# Altium project STM32F103RCT6_DEVELOPMENT_BOARD.PrjPcb
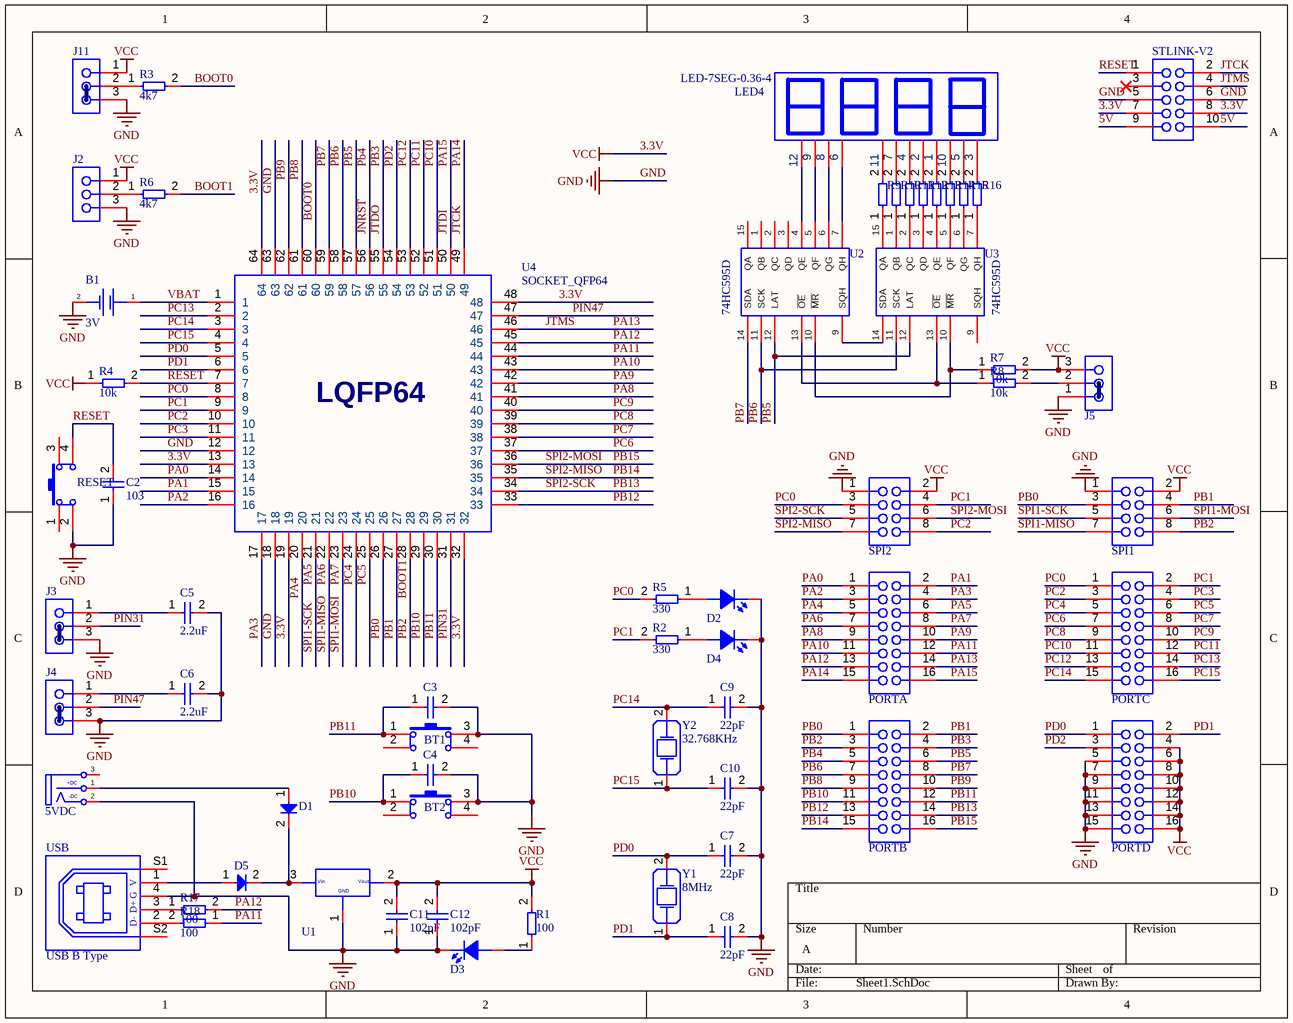
[diagram p0: Sheet1.SchDoc]
1 sheet, 59 parts. Net scope: global (net labels, ports and power ports of the same name join across sheets).
Board file: PCB1.PcbDoc

## Sheet Sheet1.SchDoc
size A

### Parts
5VDC  Connector  [DC_K375A_Power]  (value not drawn)
B1  3V  [CR1220]
BT1  Button Hole  [BUTTON_HOLE_5.0mm]  (value not drawn)
BT2  Button Hole  [BUTTON_HOLE_5.0mm]  (value not drawn)
C2  103  [C0805]
C3  103  [C0805]  (value not drawn)
C4  103  [C0805]  (value not drawn)
C5  2.2uF  [C1206]
C6  2.2uF  [C1206]
C7  22pF  [C0805]
C8  22pF  [C0805]
C9  22pF  [C0805]
C10  22pF  [C0805]
C11  102pF  [C0805]
C12  102pF  [C0805]
D1  1N4007  [DO-214AC(SMA)]  (value not drawn)
D2  LED0805  [L0805RED]  (value not drawn)
D3  LED0805  [L0805RED]  (value not drawn)
D4  LED0805  [L0805RED]  (value not drawn)
D5  1N4007  [DO-214AC(SMA)]  (value not drawn)
J2  BOOT1  [Header 3x1 TH Pitch 2.54mm]  (value not drawn)
J3  PIN31  [Header 3x1 TH Pitch 2.54mm]  (value not drawn)
J4  PIN47  [Header 3x1 TH Pitch 2.54mm]  (value not drawn)
J5  7SEG-OE  [Header 3x1 TH Pitch 2.54mm]  (value not drawn)
J11  BOOT0  [Header 3x1 TH Pitch 2.54mm]  (value not drawn)
LED4  LED-7SEG-0.36-4  [LED-7SEG-0.36-4]
PORTA  Header 8x2 TH Pitch 2.54mm  [Header 8x2 TH Pitch 2.54mm]  (value not drawn)
PORTB  Header 8x2 TH Pitch 2.54mm  [Header 8x2 TH Pitch 2.54mm]  (value not drawn)
PORTC  Header 8x2 TH Pitch 2.54mm  [Header 8x2 TH Pitch 2.54mm]  (value not drawn)
PORTD  Header 8x2 TH Pitch 2.54mm  [Header 8x2 TH Pitch 2.54mm]  (value not drawn)
R1  100  [R0805]
R2  330  [R0805]
R3  4k7  [R0805]
R4  10k  [R0805]
R5  330  [R0805]
R6  4k7  [R0805]
R7  10k  [R0805]
R8  10k  [R0805]
R9  100  [R0805]  (value not drawn)
R10  100  [R0805]  (value not drawn)
R11  100  [R0805]  (value not drawn)
R12  100  [R0805]  (value not drawn)
R13  100  [R0805]  (value not drawn)
R14  100  [R0805]  (value not drawn)
R15  100  [R0805]  (value not drawn)
R16  100  [R0805]  (value not drawn)
R17  100  [R0805]
R18  100  [R0805]
RESET  Button Hole  [BUTTON_HOLE_5.0mm]  (value not drawn)
SPI1  Header 4x2 TH Pitch 2.54mm  [Header 4x2 TH Pitch 2.54mm]  (value not drawn)
SPI2  Header 4x2 TH Pitch 2.54mm  [Header 4x2 TH Pitch 2.54mm]  (value not drawn)
STLINK-V2  IDC_2.54_5x2  [IDC_CONNECTOR_10x2.54]  (value not drawn)
U1  AMS1117  [SOT223-3]  (value not drawn)
U2  74HC595D  [SO16]
U3  74HC595D  [SO16]
U4  SOCKET_QFP64  [SOCKET_QFP64]
USB  USB B Type  [USB-B-TYPE]
Y1  8MHz  [SMD5032]
Y2  32.768KHz  [CRYSTAL 32.768]

### Nets
3.3V: C11.2 C12.2 J2.1 J5.3 J11.1 PORTD.4 PORTD.6 PORTD.8 PORTD.10 PORTD.12 PORTD.14 PORTD.16 R1.2 R4.1 R7.2 SPI1.2 SPI2.2 STLINK-V2.7 STLINK-V2.8 U1.2 U2.16 U3.16 U4.13 U4.19 U4.32 U4.48 U4.64  [also labelled VCC]
GND: 5VDC.2(DC-) B1.2 BT1.3 BT2.3 C2.1 C3.2 C4.2 C5.2 C6.2 C7.2 C8.2 C9.2 C10.2 C11.1 C12.1 D2.2(K) D3.2(K) D4.2(K) J2.3 J3.3 J4.3 J5.1 J11.3 PORTD.5 PORTD.7 PORTD.9 PORTD.11 PORTD.13 PORTD.15 RESET.2 SPI1.1 SPI2.1 STLINK-V2.5 STLINK-V2.6 U1.1 U2.8 U3.8 U4.12 U4.18 U4.63 USB.4
5V: STLINK-V2.9 STLINK-V2.10
BOOT0: R3.2 U4.60
BOOT1: PORTB.3 R6.2 SPI1.8 U4.28  [also labelled PB2]
JNRST: PORTB.5 U4.56  [also labelled Pb4]
JTCK: PORTA.15 STLINK-V2.2 U4.49  [also labelled PA14]
JTDI: PORTA.16 U4.50  [also labelled PA15]
JTDO: PORTB.4 U4.55  [also labelled PB3]
JTMS: PORTA.14 STLINK-V2.4 U4.46  [also labelled PA13]
PA0: PORTA.1 U4.14
PA1: PORTA.2 U4.15
PA2: PORTA.3 U4.16
PA3: PORTA.4 U4.17
PA4: PORTA.5 U4.20
PA5: PORTA.6 SPI1.5 U4.21  [also labelled SPI1-SCK]
PA6: PORTA.7 SPI1.7 U4.22  [also labelled SPI1-MISO]
PA7: PORTA.8 SPI1.6 U4.23  [also labelled SPI1-MOSI]
PA8: PORTA.9 U4.41
PA9: PORTA.10 U4.42
PA10: PORTA.11 U4.43
PA11: PORTA.12 R18.1 U4.44
PA12: PORTA.13 R17.2 U4.45
PB0: PORTB.1 SPI1.3 U4.26
PB1: PORTB.2 SPI1.4 U4.27
PB5: PORTB.6 U2.12(LAT) U3.12(LAT) U4.57
PB6: PORTB.7 U2.11(SCK) U3.11(SCK) U4.58
PB7: PORTB.8 U2.14(SDA) U4.59
PB8: PORTB.9 U4.61
PB9: PORTB.10 U4.62
PB10: BT2.1 C4.1 PORTB.11 U4.29
PB11: BT1.1 C3.1 PORTB.12 U4.30
PB12: PORTB.13 U4.33
PB13: PORTB.14 SPI2.5 U4.34  [also labelled SPI2-SCK]
PB14: PORTB.15 SPI2.7 U4.35  [also labelled SPI2-MISO]
PB15: PORTB.16 SPI2.6 U4.36  [also labelled SPI2-MOSI]
PC0: PORTC.1 R5.2 SPI2.3 U4.8
PC1: PORTC.2 R2.2 SPI2.4 U4.9
PC2: PORTC.3 SPI2.8 U4.10
PC3: PORTC.4 U4.11
PC4: PORTC.5 U4.24
PC5: PORTC.6 U4.25
PC6: PORTC.7 U4.37
PC7: PORTC.8 U4.38
PC8: PORTC.9 U4.39
PC9: PORTC.10 U4.40
PC10: PORTC.11 U4.51
PC11: PORTC.12 U4.52
PC12: PORTC.13 U4.53
PC13: PORTC.14 U4.2
PC14: C9.1 PORTC.15 U4.3 Y2.2
PC15: C10.1 PORTC.16 U4.4 Y2.1
PD0: C7.1 PORTD.1 U4.5 Y1.2
PD1: C8.1 PORTD.2 U4.6 Y1.1
PD2: PORTD.3 U4.54
PIN31: J3.2 U4.31
PIN47: J4.2 U4.47
RESET: C2.2 R4.2 RESET.4 STLINK-V2.1 U4.7
VBAT: B1.1 U4.1
Net5VDC_1: 5VDC.1(DS+) D1.1
NetC5_1: C5.1 J3.1
NetC6_1: C6.1 J4.1
NetD1_2: D1.2 D5.2 U1.3
NetD2_1: D2.1(A) R5.1
NetD3_1: D3.1(A) R1.1
NetD4_1: D4.1(A) R2.1
NetD5_1: D5.1 USB.1
NetJ2_2: J2.2 R6.1
NetJ5_2: J5.2 R8.2
NetJ11_2: J11.2 R3.1
NetLED4_1: LED4.1 R13.2
NetLED4_2: LED4.2 R12.2
NetLED4_3: LED4.3 R16.2
NetLED4_4: LED4.4 R11.2
NetLED4_5: LED4.5 R15.2
NetLED4_6: LED4.6 U2.7(QH)
NetLED4_7: LED4.7 R10.2
NetLED4_8: LED4.8 U2.6(QG)
NetLED4_9: LED4.9 U2.5(QF)
NetLED4_10: LED4.10 R14.2
NetLED4_11: LED4.11 R9.2
NetLED4_12: LED4.12 U2.4(QE)
NetR7_1: R7.1 U2.10(~{MR}) U3.10(~{MR})
NetR8_1: R8.1 U2.13(~{OE}) U3.13(~{OE})
NetR9_1: R9.1 U3.15(QA)
NetR10_1: R10.1 U3.1(QB)
NetR11_1: R11.1 U3.2(QC)
NetR12_1: R12.1 U3.3(QD)
NetR13_1: R13.1 U3.4(QE)
NetR14_1: R14.1 U3.5(QF)
NetR15_1: R15.1 U3.6(QG)
NetR16_1: R16.1 U3.7(QH)
NetR17_1: R17.1 USB.3
NetR18_2: R18.2 USB.2
NetU2_9: U2.9(SQH) U3.14(SDA)

Not connected (* = marked no-connect by the designer): 5VDC 3(T); BT1 2 4; BT2 2 4; RESET 1 3; STLINK-V2 3*; U2 1(QB) 2(QC) 3(QD) 15(QA); U3 9(SQH); USB S1 S2

### Notes on the sheet
- (in symbol AMS1117(SOT-223)) Vin; Vout; GND
- (in symbol JackDC) +DC; -DC
- (in symbol SOCKET_QFP64) LQFP64

### Library data of the parts
5VDC = JackDC
B1 = Batery
C2-C4 C7-C10 = C0805
C5 C6 = C1206
C11 C12 = Capacitors(SMD)
D1 D5 = Diode 1N4007-DO214AC(SMA)
J2-J5 J11 = Header 3x1 TH Pitch 2.54mm
R1-R18 = Resistor SMD
U1 = AMS1117(SOT-223)
Y1 = Crystal
Y2 = Crystal 32.768KHz